# EAGLE design mp3_shield (EAGLE 5.10)
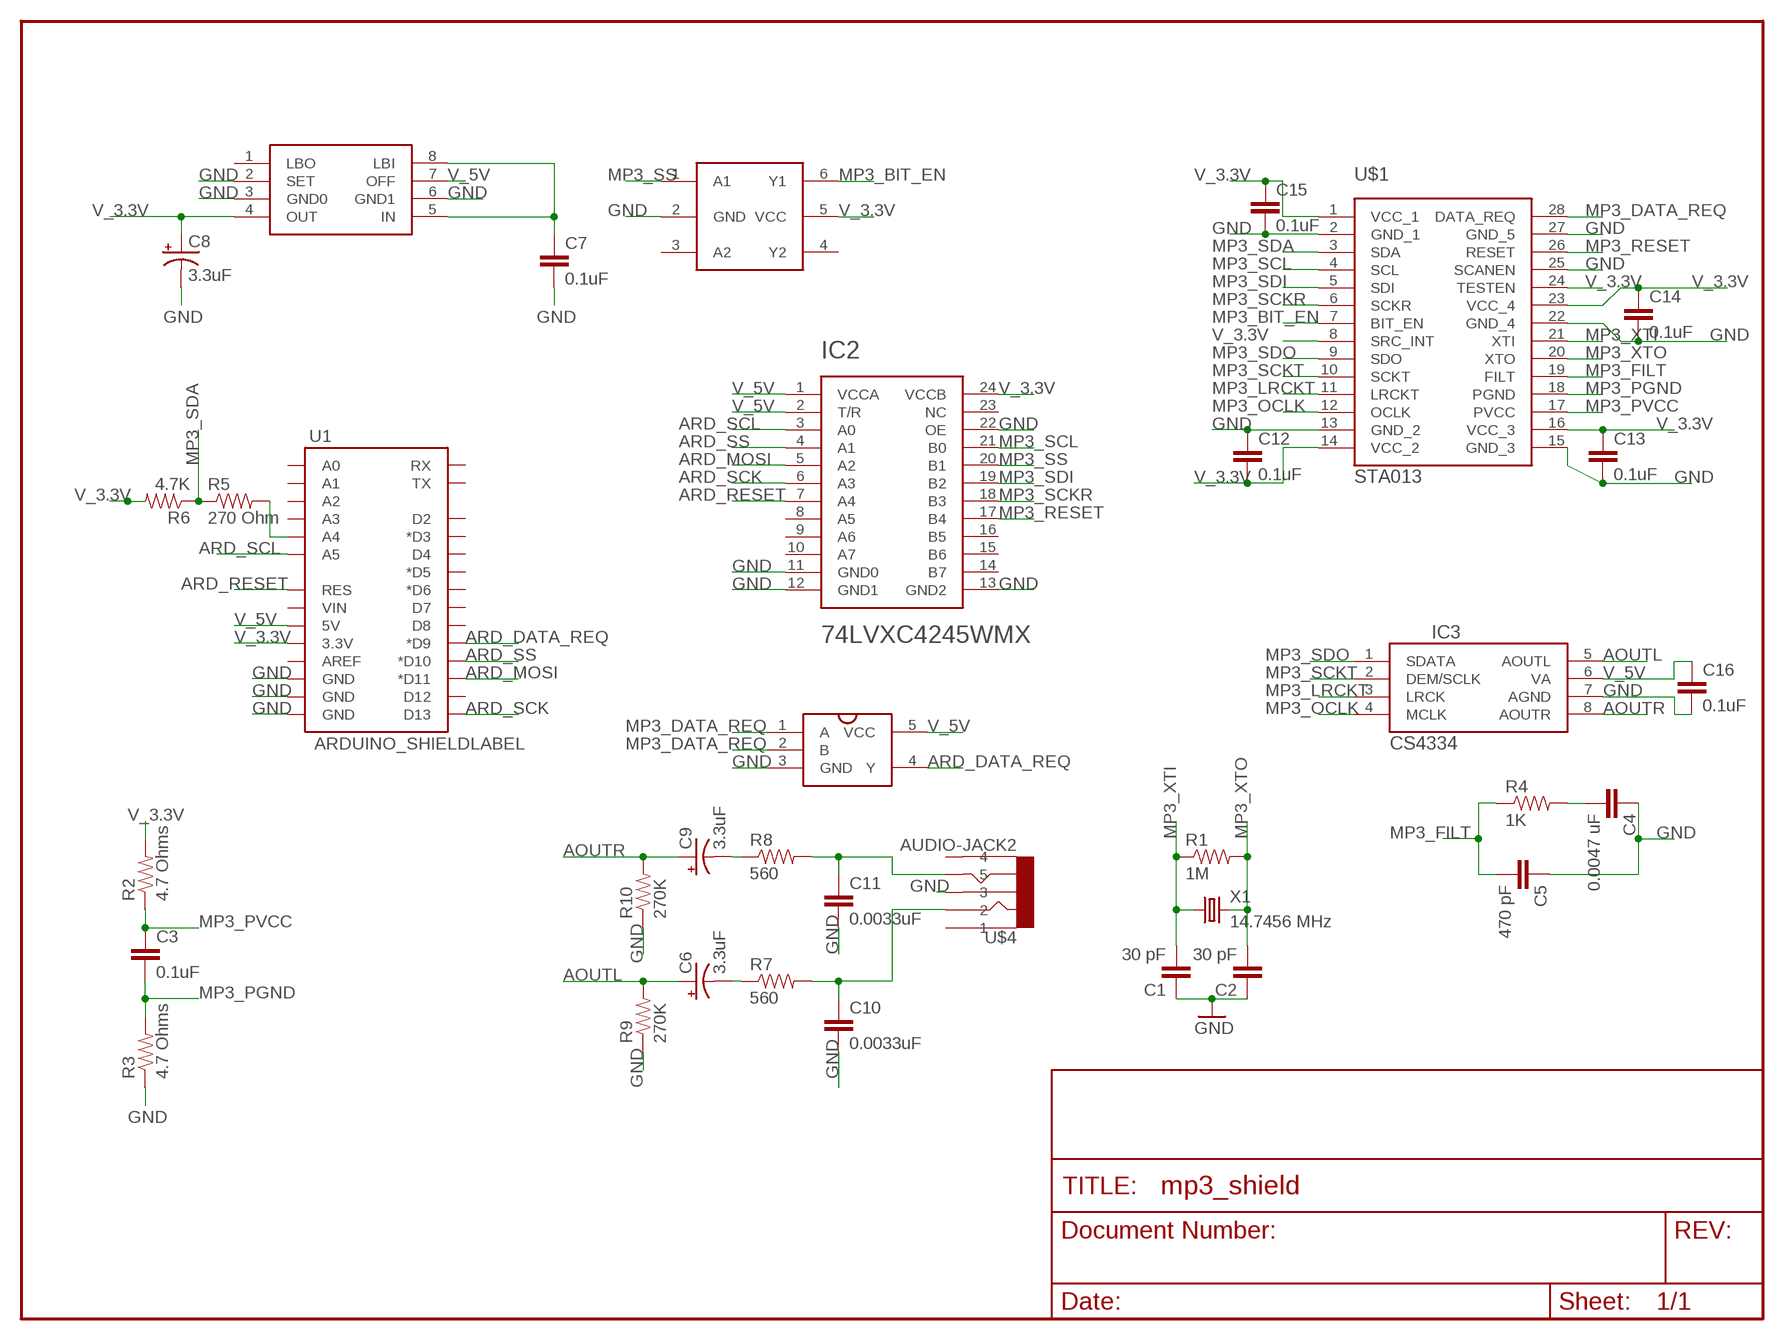
[diagram p0: schematic, sheet 1]

## Parts
C1  30 pF  CAPPTH  [CAP-PTH-SMALL]
C2  30 pF  CAPPTH  [CAP-PTH-SMALL]
C3  0.1uF  CAPPTH  [CAP-PTH-SMALL]
C4  0.0047 uF  CAPPTH  [CAP-PTH-SMALL]
C5  470 pF  CAPPTH  [CAP-PTH-SMALL]
C6  3.3uF  CAP_POLPTH2  [CPOL-RADIAL-10UF-25V]
C7  0.1uF  CAPPTH  [CAP-PTH-SMALL]
C8  3.3uF  CAP_POLPTH2  [CPOL-RADIAL-10UF-25V]
C9  3.3uF  CAP_POLPTH2  [CPOL-RADIAL-10UF-25V]
C10  0.0033uF  CAPPTH2  [CAP-PTH-SMALL2]
C11  0.0033uF  CAPPTH2  [CAP-PTH-SMALL2]
C12  0.1uF  CAPPTH  [CAP-PTH-SMALL]
C13  0.1uF  CAPPTH  [CAP-PTH-SMALL]
C14  0.1uF  CAPPTH  [CAP-PTH-SMALL]
C15  0.1uF  CAPPTH  [CAP-PTH-SMALL]
C16  0.1uF  CAPPTH  [CAP-PTH-SMALL]
IC2  74LVXC4245WMX  [SO24W]
IC3  CS4334  [SO08]
MAX884  MAX884ESA  [SO08]
R1  1M  RESISTORPTH1  [AXIAL-0.3]
R2  4.7 Ohms  RESISTORPTH1  [AXIAL-0.3]
R3  4.7 Ohms  RESISTORPTH1  [AXIAL-0.3]
R4  1K  RESISTORPTH1  [AXIAL-0.3]
R5  270 Ohm  RESISTORPTH1  [AXIAL-0.3]
R6  4.7K  RESISTORPTH1  [AXIAL-0.3]
R7  560  RESISTORPTH1  [AXIAL-0.3]
R8  560  RESISTORPTH1  [AXIAL-0.3]
R9  270K  RESISTORPTH1  [AXIAL-0.3]
R10  270K  RESISTORPTH1  [AXIAL-0.3]
U1  ARDUINO_SHIELDLABEL  [DUEMILANOVE_SHIELD]
U$1  STA013  [SO28W]
U$2  NC7WP14P6X  [SC70-6L]
U$4  AUDIO-JACK2  [AUDIO-JACK]
U$5  NC7ST08M5X  [SOT23-5L]
X1  14.7456 MHz  CRYSTALHC49S  [HC49/S]

## Nets
AOUTL: C6.1(+) IC3.5(AOUTL) R9.P$2
AOUTR: C9.1(+) IC3.8(AOUTR) R10.P$2
ARD_DATA_REQ: U1.D9(*D9) U$5.4(Y)
ARD_MOSI: IC2.5(A2) U1.D11(*D11)
ARD_RESET: IC2.7(A4) U1.RES
ARD_SCK: IC2.6(A3) U1.D13
ARD_SCL: IC2.3(A0) U1.A5
ARD_SS: IC2.4(A1) U1.D10(*D10)
GND: C1.1 C2.1 C4.1 C5.1 C7.2 C8.2(-) C10.2 C11.2 C12.1 C13.2 C14.2 C15.2 C16.2 IC2.11(GND0) IC2.12(GND1) IC2.13(GND2) IC2.22(OE) IC3.7(AGND) MAX884.2(SET) MAX884.3(GND0) MAX884.6(GND1) R3.P$1 R9.P$1 R10.P$1 U1.GND@0(GND) U1.GND@1(GND) U1.GND@2(GND) U$1.2(GND_1) U$1.13(GND_2) U$1.15(GND_3) U$1.22(GND_4) U$1.25(SCANEN) U$1.27(GND_5) U$2.2(GND) U$4.3 U$5.3(GND)
MP3_BIT_EN: U$1.7(BIT_EN) U$2.6(Y1)
MP3_DATA_REQ: U$1.28(DATA_REQ) U$5.1(A) U$5.2(B)
MP3_FILT: C5.2 R4.P$1 U$1.19(FILT)
MP3_LRCKT: IC3.3(LRCK) U$1.11(LRCKT)
MP3_OCLK: IC3.4(MCLK) U$1.12(OCLK)
MP3_PGND: C3.2 R3.P$2 U$1.18(PGND)
MP3_PVCC: C3.1 R2.P$1 U$1.17(PVCC)
MP3_RESET: IC2.17(B4) U$1.26(RESET)
MP3_SCKR: IC2.18(B3) U$1.6(SCKR)
MP3_SCKT: IC3.2(DEM/SCLK) U$1.10(SCKT)
MP3_SCL: IC2.21(B0) U$1.4(SCL)
MP3_SDA: R5.P$1 R6.P$1 U$1.3(SDA)
MP3_SDI: IC2.19(B2) U$1.5(SDI)
MP3_SDO: IC3.1(SDATA) U$1.9(SDO)
MP3_SS: IC2.20(B1) U$2.1(A1)
MP3_XTI: C1.2 R1.P$1 U$1.21(XTI) X1.1
MP3_XTO: C2.2 R1.P$2 U$1.20(XTO) X1.2
N$2: R5.P$2 U1.A4
N$3: C9.2(-) R8.P$1
N$4: C11.1 R8.P$2 U$4.5
N$8: C6.2(-) R7.P$1
N$9: C10.1 R7.P$2 U$4.2
N$10: C4.2 R4.P$2
N$21: C7.1 MAX884.5(IN) MAX884.8(LBI)
V_3.3V: C8.1(+) C12.2 C13.1 C14.1 C15.1 IC2.24(VCCB) MAX884.4(OUT) R2.P$2 R6.P$2 U1.3.3V U$1.1(VCC_1) U$1.8(SRC_INT) U$1.14(VCC_2) U$1.16(VCC_3) U$1.23(VCC_4) U$1.24(TESTEN) U$2.5(VCC)
V_5V: C16.1 IC2.1(VCCA) IC2.2(T/R) IC3.6(VA) MAX884.7(OFF) U1.5V U$5.5(VCC)
Unconnected: IC2.8(A5) IC2.9(A6) IC2.10(A7) IC2.14(B7) IC2.15(B6) IC2.16(B5) IC2.23(NC) MAX884.1(LBO) U1.A0 U1.A1 U1.A2 U1.A3 U1.AREF U1.D2 U1.D3(*D3) U1.D4 U1.D5(*D5) U1.D6(*D6) U1.D7 U1.D8 U1.D12 U1.RX U1.TX U1.VIN U$2.3(A2) U$2.4(Y2) U$4.1 U$4.4

## Library data of the parts
C1-C5 C7 C10-C16 = SparkFun:CAP: Capacitor Standard 0603 ceramic capacitor, and 0.1" leaded capacitor.
C6 C8 C9 = SparkFun:CAP_POL: Capacitor Polarized These are standard SMD and PTH capacitors. Normally 10uF, 47uF, and 100uF in electrolytic and tantalum varieties. Always verify the external diameter of the through hole cap, it varies with capacity, voltage, and manufacturer. The EIA devices should be standard.
IC2 = ideabot:74LVXC4245WMX
IC3 = ideabot:CS4334: CS4334 DAC produced by Cirrus Logic
MAX884 = mp3:MAX884ESA
R1-R10 = SparkFun:RESISTOR: Resistor Basic schematic elements and footprints for 0603, 1206, and PTH 1/10th watt (small) resistors.
U1 = SparkFun:ARDUINO_SHIELD
U$1 = ideabot:STA013
U$2 = mp3:NC7WP14P6X: 0.9V to 3.6V VCC supply operation
U$4 = SparkFun:AUDIO-JACK2
U$5 = ideabot:NC7ST08M5X
X1 = crystal:CRYSTAL: CRYSTAL

## Board
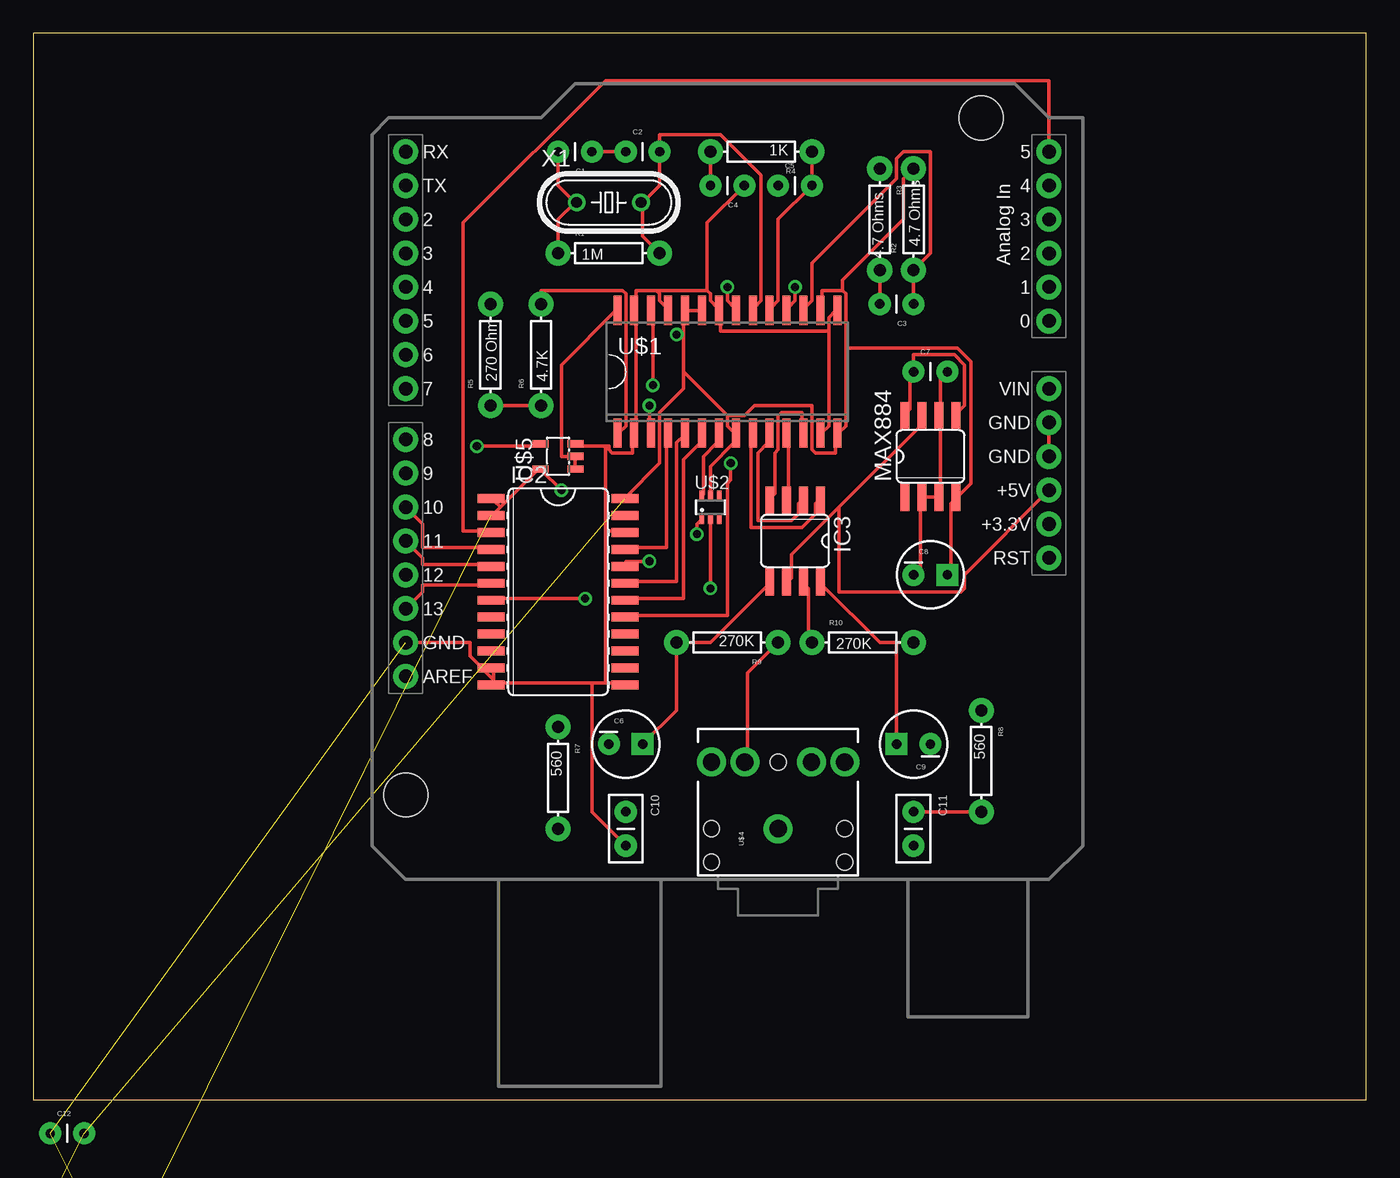
[diagram p1: board, top side]
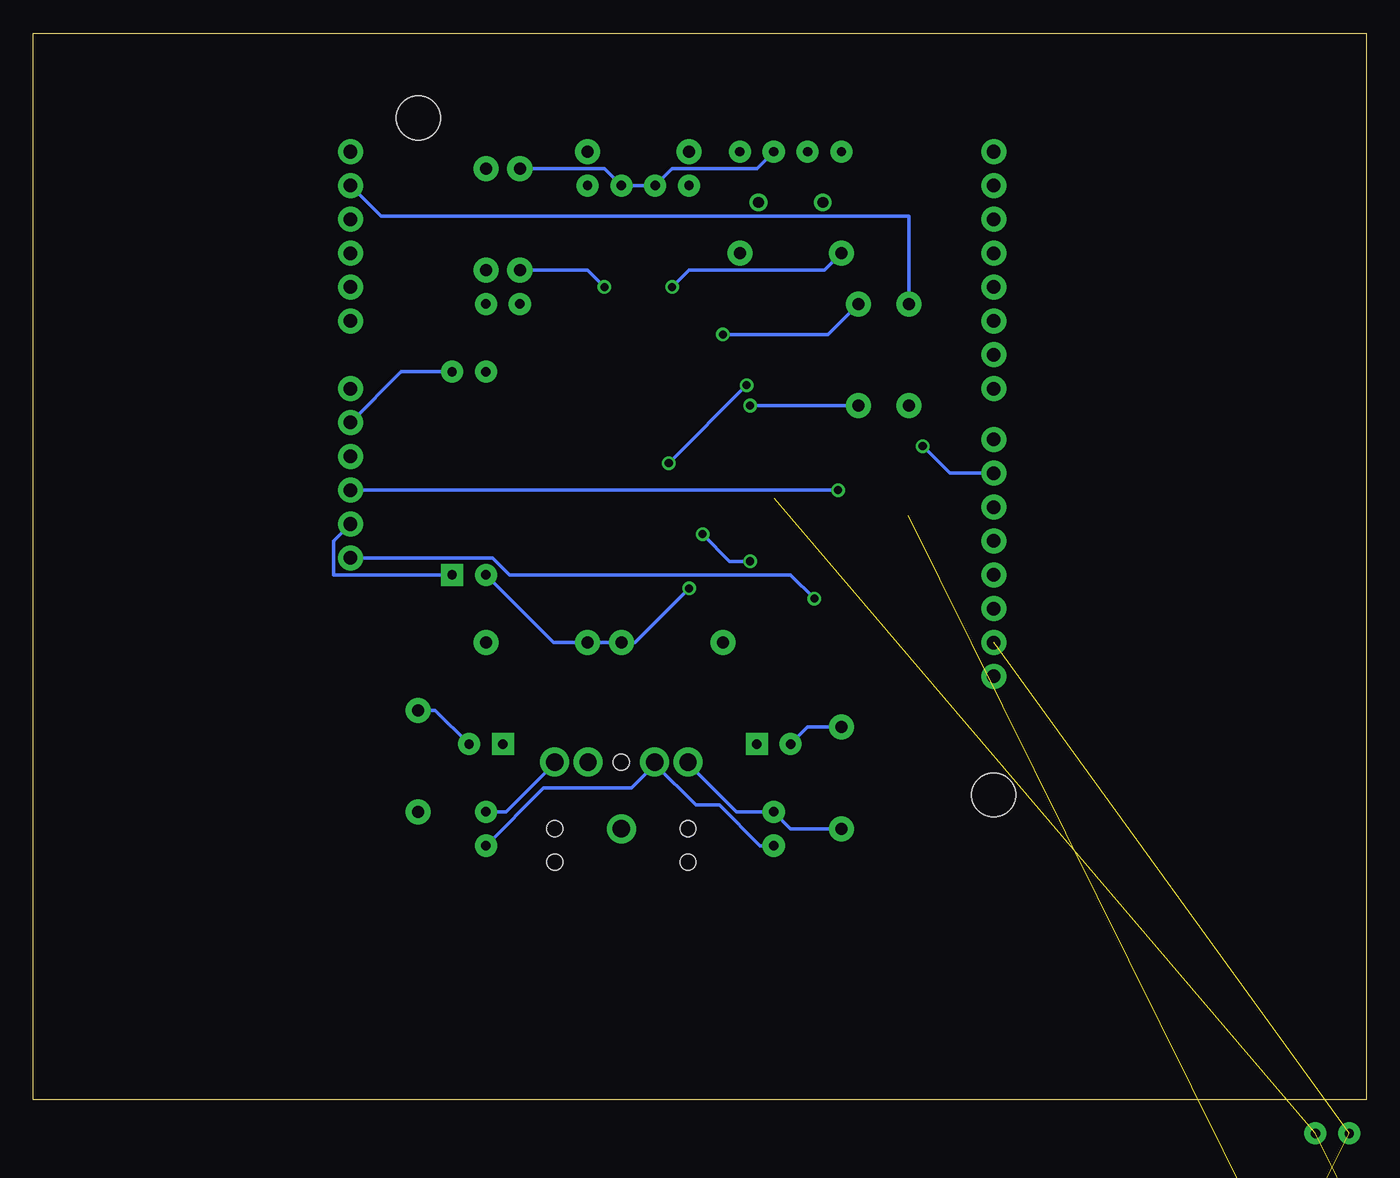
[diagram p2: board, bottom side, seen from below]

Size 100 x 80 mm. Coordinates in mm from the lower left corner, seen from the top.
Outline: 0,0 100,0 100,80 0,80 0,0
Copper layers (1*16): Top 0.035mm / dielectric 1.5mm / Bottom 0.035mm
Design rules "default": minimum track width 10mil, minimum drill 24mil, track to track 8mil, track to pad 8mil, pad to pad 8mil, via to via 8mil, smd to smd 8mil, copper to edge 40mil, drill to drill 8mil, minimum pad ring 10mil, minimum via ring 8mil, stop-mask expansion 4mil, vias tented up to drill 0mil, thermal gap 10mil

### Footprints (pad centres in the part's own frame; a part is rotated, then mirrored left to right if it is on the bottom)
CAP-PTH-SMALL = drill 0.7 pad 1.651 round: 1 0,0; 2 2.54,0
CPOL-RADIAL-10UF-25V = drill 0.7 pad 1.651 square: 1 1.27,0 | drill 0.7 pad 1.651 round: 2 -1.27,0
CAP-PTH-SMALL2 = drill 0.7 pad 1.651 round: 1 0,0; 2 2.54,0
SO24W = smd 0.66 x 2.032: 1 -6.985,-5.029; 2 -5.715,-5.029; 3 -4.445,-5.029; 4 -3.175,-5.029; 5 -1.905,-5.029; 6 -0.635,-5.029; 7 0.635,-5.029; 8 1.905,-5.029; 9 3.175,-5.029; 10 4.445,-5.029; 11 5.715,-5.029; 12 6.985,-5.029; 13 6.985,5.029; 14 5.715,5.029; 15 4.445,5.029; 16 3.175,5.029; 17 1.905,5.029; 18 0.635,5.029; 19 -0.635,5.029; 20 -1.905,5.029; 21 -3.175,5.029; 22 -4.445,5.029; 23 -5.715,5.029; 24 -6.985,5.029
SO08 = smd 0.66 x 2.032: 1 -1.905,-3.073; 2 -0.635,-3.073; 3 0.635,-3.073; 4 1.905,-3.073; 5 1.905,3.073; 6 0.635,3.073; 7 -0.635,3.073; 8 -1.905,3.073
AXIAL-0.3 = drill 0.9 pad 1.88 round: P$1 -3.81,0; P$2 3.81,0
DUEMILANOVE_SHIELD = drill 1.016 pad 1.88 round: 3.3V 50.8,26.67; 5V 50.8,29.21; A0 50.8,41.91; A1 50.8,44.45; A2 50.8,46.99; A3 50.8,49.53; A4 50.8,52.07; A5 50.8,54.61; AREF 2.54,15.24; D2 2.54,49.53; D3 2.54,46.99; D4 2.54,44.45; D5 2.54,41.91; D6 2.54,39.37; D7 2.54,36.83; D8 2.54,33.02; D9 2.54,30.48; D10 2.54,27.94; D11 2.54,25.4; D12 2.54,22.86; D13 2.54,20.32; GND@0 50.8,31.75; GND@1 50.8,34.29; GND@2 2.54,17.78; RES 50.8,24.13; RX 2.54,54.61; TX 2.54,52.07; VIN 50.8,36.83 | hole 3.302: 45.72,57.15; 2.54,6.35
SO28W = smd 0.6 x 2.2: 1 -8.255,-4.6; 2 -6.985,-4.6; 3 -5.715,-4.6; 4 -4.445,-4.6; 5 -3.175,-4.6; 6 -1.905,-4.6; 7 -0.635,-4.6; 8 0.635,-4.6; 9 1.905,-4.6; 10 3.175,-4.6; 11 4.445,-4.6; 12 5.715,-4.6; 13 6.985,-4.6; 14 8.255,-4.6; 15 8.255,4.6; 16 6.985,4.6; 17 5.715,4.6; 18 4.445,4.6; 19 3.175,4.6; 20 1.905,4.6; 21 0.635,4.6; 22 -0.635,4.6; 23 -1.905,4.6; 24 -3.175,4.6; 25 -4.445,4.6; 26 -5.715,4.6; 27 -6.985,4.6; 28 -8.255,4.6
SC70-6L = smd 0.35 x 0.8: 1 -0.65,-0.85; 2 0,-0.85; 3 0.65,-0.85; 4 0.65,0.85; 5 0,0.85; 6 -0.65,0.85
AUDIO-JACK = drill 1.3 pad 2.184 round: 1 0,0; 2 5,5; 3 5,2.5; 4 5,-2.5; 5 5,-5 | hole 1.2: 0,5; -2.5,5; -2.5,-5; 0,-5; 5,0
SOT23-5L = smd 0.55 x 1.2: 1 -0.95,-1.3; 2 0,-1.3; 3 0.95,-1.3; 4 0.95,1.3; 5 -0.95,1.3
HC49/S = drill 0.813 round: 1 -2.413,0; 2 2.413,0

### Placement (x,y rotation side)
C1  41.91,71.12 180 top
C2  44.45,71.12 0 top
C3  66.04,59.69 180 top
C4  53.34,68.58 180 top
C5  55.88,68.58 0 top
C6  44.45,26.67 0 top
C7  66.04,54.61 0 top
C8  67.31,39.37 0 top
C9  66.04,26.67 180 top
C10  44.45,21.59 270 top
C11  66.04,21.59 270 top
C12  1.27,-2.54 0 top
C13  1.27,-7.62 0 top  (outside the outline)
C14  1.27,-12.7 0 top  (outside the outline)
C15  1.27,-17.78 0 top  (outside the outline)
C16  1.27,-22.86 0 top  (outside the outline)
IC2  39.37,38.1 270 top
IC3  57.15,41.91 180 top
MAX884  67.31,48.26 0 top
R1  43.18,63.5 0 top
R2  66.04,66.04 90 top
R3  63.5,66.04 270 top
R4  54.61,71.12 180 top
R5  34.29,55.88 90 top
R6  38.1,55.88 90 top
R7  39.37,24.13 270 top
R8  71.12,25.4 270 top
R9  52.07,34.29 180 top
R10  62.23,34.29 0 top
U1  25.4,16.51 0 top
U$1  52.07,54.61 0 top
U$2  50.8,44.45 0 top
U$4  55.88,20.32 90 top
U$5  39.37,48.26 90 top
X1  43.18,67.31 0 top

### Tracks (layer width: path | path; a pad name or v marks a point on that pad's centre or on a via)
AOUTL
  Top 0.254: IC3.5 55.12,38.61 50.8,34.29 R9.P$2 48.26,29.21 C6.1
AOUTR
  Top 0.254: 64.77,34.29 R10.P$2 | 64.77,34.29 63.5,34.29 59.18,38.61 IC3.8 | C9.1 64.77,34.29
ARD_DATA_REQ  (via drill 0.61)
  Top 0.254: v33.27,49.02 37.85,49.02 U$5.4
  Bottom 0.254: v33.27,49.02 31.24,46.99 U1.D9
ARD_MOSI
  Top 0.254: U1.D11 29.21,40.64 29.21,40.13 34.29,40.13 IC2.5
ARD_RESET  (via drill 0.61)
  Top 0.254: v41.4,37.59 34.54,37.59 IC2.7
  Bottom 0.254: v41.4,37.59 43.18,39.37 64.26,39.37 65.53,40.64 U1.RES
ARD_SCK
  Top 0.254: U1.D13 29.21,38.1 29.21,38.61 34.29,38.61 IC2.6
ARD_SCL
  Top 0.254: U1.A5 76.2,76.45 42.93,76.45 32.26,65.79 32.26,42.67 34.29,42.67 IC2.3
ARD_SS
  Top 0.254: U1.D10 29.21,43.18 29.21,41.4 34.29,41.4 IC2.4
GND  (via drill 0.61)  (5 unrouted)
  Top 0.254: U1.GND@1 U1.GND@0 | C8.2 66.55,39.88 66.55,44.96 MAX884.2 66.8,45.21 67.82,45.21 MAX884.3 68.07,45.21 68.07,51.31 MAX884.6 68.07,51.56 68.07,54.1 C7.2 | R10.P$1 58.17,34.54 58.17,38.35 57.91,38.61 IC3.7 | v50.8,38.35 U$2.2 | R9.P$1 53.59,32 53.59,25.4 U$4.3 | 34.54,31.5 34.54,32.26 IC2.11 | 34.54,31.24 34.54,31.5 | 41.91,31.24 34.54,31.24 | 41.91,31.24 42.93,31.24 | 42.93,31.24 44.2,31.24 IC2.13 | 34.54,31.24 IC2.12 | C10.2 41.91,21.59 41.91,31.24 | U1.GND@2 32.77,34.29 32.77,33.27 34.54,31.5 | C2.1 C1.1 | 59.69,57.66 59.69,58.67 60.2,59.18 U$1.15 | 59.69,57.66 59.69,50.55 59.18,50.04 U$1.13 | 42.93,49.02 43.18,49.02 43.18,48.77 43.43,48.51 44.96,48.51 44.96,49.78 U$1.2 45.21,50.04 45.21,59.18 U$1.27 45.21,59.44 45.21,60.71 46.74,60.71 | 42.93,49.02 40.89,49.02 U$5.3 | 42.93,42.67 44.2,42.67 IC2.22 | 42.93,42.67 42.93,49.02 | 46.74,60.71 46.99,60.45 46.99,59.94 47.5,59.44 U$1.25 | 50.55,60.71 50.8,60.45 50.8,59.94 51.31,59.44 U$1.22 51.56,59.18 51.56,57.66 59.69,57.66 | 46.74,60.71 50.55,60.71 | C4.1 50.55,65.79 50.55,60.71 | 42.93,31.24 42.93,42.67
  Bottom 0.254: U1.GND@1 72.39,54.61 C7.2 | v50.8,38.35 54.86,34.29 R9.P$1 R10.P$1 60.96,34.29 C8.2 | C11.2 61.72,23.37 55.12,23.37 53.34,25.15 | R3.P$1 57.15,69.85 C5.1 C4.1 52.07,69.85 45.72,69.85 C2.1 | 53.34,25.15 50.29,22.1 48.51,22.1 45.47,19.05 C10.2 | 53.34,25.15 U$4.3
MP3_BIT_EN
  Top 0.254: U$2.6 50.29,45.47 50.29,48.26 51.31,49.28 51.31,49.78 U$1.7
MP3_DATA_REQ
  Top 0.254: 40.64,48.26 40.64,47.5 U$5.1 | 40.64,48.26 39.62,48.26 39.62,55.12 43.69,59.18 U$1.28 | 40.64,48.26 U$5.2
MP3_FILT
  Top 0.254: U$1.19 55.37,59.44 55.88,59.94 55.88,66.04 C5.2 R4.P$1
MP3_LRCKT
  Top 0.254: IC3.3 56.64,45.21 56.64,49.78 U$1.11
MP3_OCLK
  Top 0.254: IC3.4 55.37,45.21 55.63,45.47 55.63,48.51 55.88,48.77 55.88,51.31 56.13,51.56 57.66,51.56 57.66,50.04 U$1.12
MP3_PGND  (via drill 0.61)
  Top 0.254: v57.15,60.96 57.15,59.94 56.64,59.44 U$1.18 | R3.P$2 C3.2
  Bottom 0.254: v57.15,60.96 58.42,62.23 R3.P$2
MP3_PVCC
  Top 0.254: U$1.17 57.91,59.44 58.42,59.94 58.42,62.74 64.77,69.09 64.77,70.61 65.28,71.12 67.31,71.12 67.31,63.5 R2.P$1 C3.1
MP3_RESET  (via drill 0.61)
  Top 0.254: v52.32,47.75 52.32,46.48 52.07,46.23 52.07,36.32 44.45,36.32 IC2.17 | v46.48,53.59 46.48,59.18 U$1.26
  Bottom 0.254: v52.32,47.75 v46.48,53.59
MP3_SCKR
  Top 0.254: IC2.18 44.45,37.59 48.77,37.59 48.77,48.01 50.04,49.28 50.04,49.78 U$1.6
MP3_SCKT
  Top 0.254: IC3.2 57.66,44.96 57.4,44.7 57.4,43.94 56.9,43.43 54.36,43.43 54.36,48.51 55.12,49.28 55.12,49.78 U$1.10
MP3_SCL
  Top 0.254: IC2.21 44.45,41.4 47.5,41.4 47.5,49.78 U$1.4
MP3_SDA  (via drill 0.61)
  Top 0.254: v46.23,52.07 46.23,50.04 U$1.3 | R5.P$1 R6.P$1
  Bottom 0.254: R6.P$1 v46.23,52.07
MP3_SDI
  Top 0.254: IC2.19 44.45,38.86 48.26,38.86 48.26,49.28 48.77,49.78 U$1.5
MP3_SDO
  Top 0.254: IC3.1 58.93,44.96 58.67,44.7 58.67,43.94 57.66,42.93 53.85,42.93 53.85,49.78 U$1.9
MP3_SS  (via drill 0.61)
  Top 0.254: v49.78,42.42 49.78,43.18 50.04,43.43 U$2.1 | v46.23,40.39 44.45,40.39 44.45,40.13 IC2.20
  Bottom 0.254: v49.78,42.42 47.75,40.39 v46.23,40.39
MP3_XTI  (via drill 0.61)
  Top 0.254: 40.64,67.31 39.37,68.58 C1.2 | v52.07,60.96 52.07,59.94 52.58,59.44 U$1.21 | 40.64,67.31 39.37,66.04 R1.P$1 | 40.64,67.31 X1.1
  Bottom 0.254: v52.07,60.96 50.8,62.23 40.64,62.23 R1.P$1
MP3_XTO
  Top 0.254: U$1.20 54.1,59.44 54.61,59.94 54.61,69.34 51.56,72.39 46.99,72.39 C2.2 46.99,68.58 45.72,67.31 | R1.P$2 45.72,64.77 45.72,67.31 | X1.2 45.72,67.31
N$2
  Bottom 0.254: R5.P$2 34.29,66.29 73.91,66.29 U1.A4
N$3
  Bottom 0.254: C9.2 69.85,29.21 R8.P$1
N$4
  Top 0.254: C11.1 R8.P$2
  Bottom 0.254: C11.1 64.52,21.59 60.96,25.15 U$4.5
N$8
  Bottom 0.254: C6.2 41.91,27.94 R7.P$1
N$9
  Bottom 0.254: R7.P$2 43.18,20.32 C10.1 47.24,21.59 50.8,25.15 U$4.2
N$10
  Top 0.254: C4.2 R4.P$2
N$21
  Top 0.254: MAX884.8 65.53,51.56 65.79,51.82 65.79,54.36 C7.1 66.04,55.88 69.09,55.88 69.85,55.12 69.85,52.07 69.34,51.56 MAX884.5
V_3.3V  (via drill 0.61)  (4 unrouted)
  Top 0.254: R6.P$2 38.1,60.71 44.2,60.71 44.45,60.45 44.45,50.55 43.94,50.04 U$1.1 | U$2.5 50.8,47.5 52.58,49.28 52.58,49.78 U$1.8 52.58,50.04 52.07,50.55 52.07,51.31 | 48.77,57.4 48.77,59.18 U$1.24 49.02,59.18 50.04,59.18 U$1.23 | 48.77,54.61 48.77,57.4 | 48.77,54.61 48.77,53.34 46.99,51.56 46.99,47.75 44.45,45.21 IC2.24 | 48.77,54.61 52.07,51.31 | 48.77,57.4 v48.26,57.4 | C8.1 68.83,39.62 68.83,44.7 69.09,44.96 MAX884.4 69.34,45.21 70.36,46.23 70.36,55.37 69.34,56.39 60.96,56.39 | 60.96,56.39 60.96,60.45 60.71,60.71 | 60.96,56.39 60.96,50.55 60.45,50.04 U$1.14 60.2,49.78 60.2,48.51 58.67,48.51 58.42,48.77 58.42,52.07 54.1,52.07 53.34,51.31 52.07,51.31 | 60.71,60.71 59.18,60.71 59.18,59.44 U$1.16 | R2.P$2 65.28,69.09 65.28,66.04 60.71,61.47 60.71,60.71
  Bottom 0.254: R6.P$2 40.39,57.4 v48.26,57.4 | U1.3.3V 77.47,41.91 77.47,39.37 C8.1
V_5V  (via drill 0.61)  (1 unrouted)
  Top 0.254: 35.05,44.45 34.54,43.94 IC2.2 | 35.05,44.45 37.85,47.24 U$5.5 38.1,47.24 v39.62,45.72 | 35.05,44.45 34.54,44.96 IC2.1 | 60.45,44.45 66.55,50.55 66.55,51.31 MAX884.7 | 60.45,44.45 56.9,40.89 56.9,39.12 56.64,38.86 IC3.6 | U1.5V 69.85,39.37 69.85,38.35 69.6,38.1 60.45,38.1 60.45,44.45
  Bottom 0.254: v39.62,45.72 U1.5V